# EAGLE design zx48_to_128-EASY_6b (EAGLE 5.11)
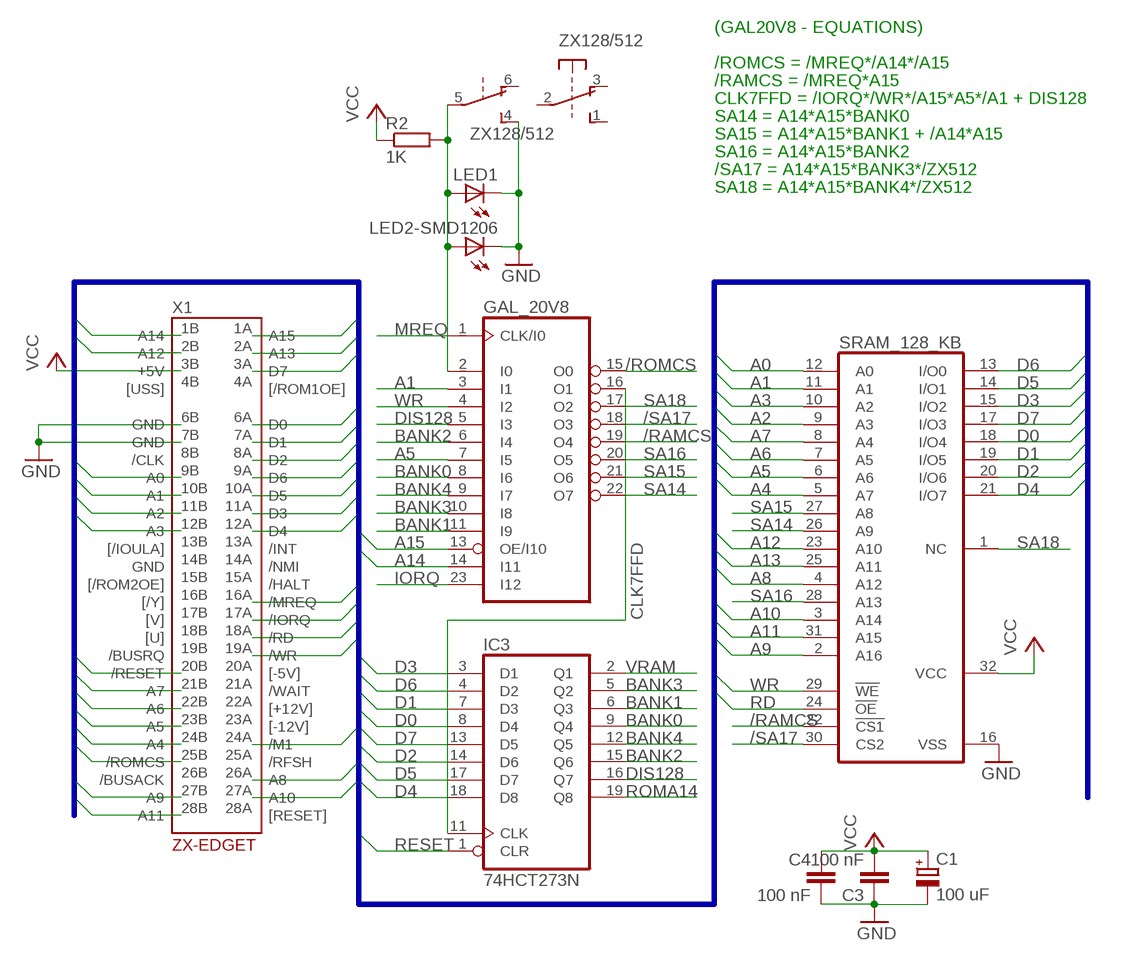
[diagram p0: schematic, sheet 1]

## Parts
C1  100 uF  CPOL-EUTT2D5L  [TT2D5L]
C3  100 nF  C-EU050-024X044  [C050-024X044]
C4  100 nF  C-EUC0805K  [C0805K]
GAL_20V8  20V8  [DIL24-3]
IC3  74HCT273N  [DIL20]
LED1  LED3MM  [LED3MM]
LED2-SMD1206  LEDCHIPLED_1206  [CHIPLED_1206]
R2  1K  R-EU_0204/2V  [0204V]
SRAM_128_KB  628128P  [DIL32]
X1  ZX-EDGET  [ZX-THR]
ZX128/512  9077-2  [9077-2]

## Nets
/RAMCS: GAL_20V8.19(O4) SRAM_128_KB.22(!CS1)
/ROMCS: GAL_20V8.15(O0)
/SA17: GAL_20V8.18(O3) SRAM_128_KB.30(CS2)
A0: SRAM_128_KB.12(A0) X1.9B(A0)
A1: GAL_20V8.3(I1) SRAM_128_KB.11(A1) X1.10B(A1)
A2: SRAM_128_KB.9(A3) X1.11B(A2)
A3: SRAM_128_KB.10(A2) X1.12B(A3)
A4: SRAM_128_KB.5(A7) X1.24B(A4)
A5: GAL_20V8.7(I5) SRAM_128_KB.6(A6) X1.23B(A5)
A6: SRAM_128_KB.7(A5) X1.22B(A6)
A7: SRAM_128_KB.8(A4) X1.21B(A7)
A8: SRAM_128_KB.4(A12) X1.26A(A8)
A9: SRAM_128_KB.2(A16) X1.27B(A9)
A10: SRAM_128_KB.3(A14) X1.27A(A10)
A11: SRAM_128_KB.31(A15) X1.28B(A11)
A12: SRAM_128_KB.23(A10) X1.2B(A12)
A13: SRAM_128_KB.25(A11) X1.2A(A13)
A14: GAL_20V8.14(I11) X1.1B(A14)
A15: GAL_20V8.13(OE/I10) X1.1A(A15)
BANK0: GAL_20V8.8(I6) IC3.9(Q4)
BANK1: GAL_20V8.11(I9) IC3.6(Q3)
BANK2: GAL_20V8.6(I4) IC3.15(Q6)
BANK3: GAL_20V8.10(I8) IC3.5(Q2)
BANK4: GAL_20V8.9(I7) IC3.12(Q5)
CLK7FFD: GAL_20V8.16(O1) IC3.11(CLK)
D0: IC3.8(D4) SRAM_128_KB.18(I/O4) X1.6A(D0)
D1: IC3.7(D3) SRAM_128_KB.19(I/O5) X1.7A(D1)
D2: IC3.14(D6) SRAM_128_KB.20(I/O6) X1.8A(D2)
D3: IC3.3(D1) SRAM_128_KB.15(I/O2) X1.11A(D3)
D4: IC3.18(D8) SRAM_128_KB.21(I/O7) X1.12A(D4)
D5: IC3.17(D7) SRAM_128_KB.14(I/O1) X1.10A(D5)
D6: IC3.4(D2) SRAM_128_KB.13(I/O0) X1.9A(D6)
D7: IC3.13(D5) SRAM_128_KB.17(I/O3) X1.3A(D7)
DIS128: GAL_20V8.5(I3) IC3.16(Q7)
GND: C1.- C3.1 C4.2 LED1.K(C) LED2-SMD1206.C SRAM_128_KB.16(VSS) X1.6B(GND) X1.7B(GND) ZX128/512.4(2:S)
IORQ: GAL_20V8.23(I12) X1.17A(/IORQ)
M1: X1.24A(/M1)
MREQ: GAL_20V8.1(CLK/I0) X1.16A(/MREQ)
N$1: GAL_20V8.2(I0) LED1.A LED2-SMD1206.A R2.2 ZX128/512.5(2:P)
RD: SRAM_128_KB.24(!OE) X1.18A(/RD)
RESET: IC3.1(CLR) X1.20B(/RESET)
ROMA14: IC3.19(Q8)
ROMCS: X1.25B(/ROMCS)
SA14: GAL_20V8.22(O7) SRAM_128_KB.26(A9)
SA15: GAL_20V8.21(O6) SRAM_128_KB.27(A8)
SA16: GAL_20V8.20(O5) SRAM_128_KB.28(A13)
SA18: GAL_20V8.17(O2) SRAM_128_KB.1(NC)
VCC: C1.+ C3.2 C4.1 R2.1 SRAM_128_KB.32(VCC) X1.3B(+5V)
VRAM: IC3.2(Q1)
WR: GAL_20V8.4(I2) SRAM_128_KB.29(!WE) X1.19A(/WR)
Unconnected: X1.4A([/ROM1OE]) X1.4B([USS]) X1.8B(/CLK) X1.13A(/INT) X1.13B([/IOULA]) X1.14A(/NMI) X1.14B(GND) X1.15A(/HALT) X1.15B([/ROM2OE]) X1.16B([/Y]) X1.17B([V]) X1.18B([U]) X1.19B(/BUSRQ) X1.20A([-5V]) X1.21A(/WAIT) X1.22A([+12V]) X1.23A([-12V]) X1.25A(/RFSH) X1.26B(/BUSACK) X1.28A([RESET]) ZX128/512.1(1:S) ZX128/512.2(1:P) ZX128/512.3(1:O) ZX128/512.6(2:O)

## Buses
A[0..15],D[0..7],MREQ,IORQ,RD,WR,M1,ROMCS,RESET

## Notes on the sheet
- (GAL20V8 - EQUATIONS)
- /ROMCS = /MREQ*/A14*/A15
- /RAMCS = /MREQ*A15
- CLK7FFD = /IORQ*/WR*/A15*A5*/A1 + DIS128
- SA14 = A14*A15*BANK0
- SA15 = A14*A15*BANK1 + /A14*A15
- SA16 = A14*A15*BANK2
- /SA17 = A14*A15*BANK3*/ZX512
- SA18 = A14*A15*BANK4*/ZX512

## Power pins joined to a net without a drawn wire
GND: GAL_20V8.12(GND) IC3.10(GND)
VCC: GAL_20V8.24(VCC) IC3.20(VCC)

## Library data of the parts
C1 = rcl:CPOL-EU: POLARIZED CAPACITOR, European symbol
C3 C4 = rcl:C-EU: CAPACITOR, European symbol
GAL_20V8 = pal:20V8: PAL
IC3 = 74xx-eu:74*273: Octal D type FLIP FLOP, clear
LED1 LED2-SMD1206 = led:LED: LED OSRAM: - CHIPLED LG R971, LG N971, LY N971, LG Q971, LY Q971, LO R971, LY R971 LH N974, LH R974 LS Q976, LO Q976, LY Q976 LO Q996 - Hyper CHIPLED LW Q18S LB Q993, LB Q99A, LB R99A - SideLED LS A670, LO A670, LY A670, LG A670, LP A670 LB A673, LV A673, LT A673, LW A673 LH A674 LY A675 LS A676, LA A676, LO A676, LY A676, LW A676 LS A679, LY A679, LG A679 - Hyper Micro SIDELED® LS Y876, LA Y876, LO Y876, LY Y876 LT Y87S - SmartLED LW L88C, LW L88S LB L89C, LB L89S, LG L890 LS L89K, LO L89K, LY L89K LS L896, LA L896, LO L896, LY L896 - TOPLED LS T670, LO T670, LY T670, LG T670, LP T670 LSG T670, LSP T670, LSY T670, LOP T670, LYG T670 LG T671, LOG T671, LSG T671 LB T673, LV T673, LT T673, LW T673 LH T674 LS T676, LA T676, LO T676, LY T676, LB T676, LH T676, LSB T676, LW T676 LB T67C, LV T67C, LT T67C, LS T67K, LO T67K, LY T67K, LW E67C LS E67B, LA E67B, LO E67B, LY E67B, LB E67C, LV E67C, LT E67C LW T67C LS T679, LY T679, LG T679 LS T770, LO T770, LY T770, LG T770, LP T770 LB T773, LV T773, LT T773, LW T773 LH T774 LS E675, LA E675, LY E675, LS T675 LS T776, LA T776, LO T776, LY T776, LB T776 LHGB T686 LT T68C, LB T68C - Hyper Mini TOPLED® LB M676 - Mini TOPLED Santana® LG M470 LS M47K, LO M47K, LY M47K Source: http://www.osram.convergy.de LUXEON: - LUMILED® LXK2-PW12-R00, LXK2-PW12-S00, LXK2-PW14-U00, LXK2-PW14-V00 LXK2-PM12-R00, LXK2-PM12-S00, LXK2-PM14-U00 LXK2-PE12-Q00, LXK2-PE12-R00, LXK2-PE12-S00, LXK2-PE14-T00, LXK2-PE14-U00 LXK2-PB12-K00, LXK2-PB12-L00, LXK2-PB12-M00, LXK2-PB14-N00, LXK2-PB14-P00, LXK2-PB14-Q00 LXK2-PR12-L00, LXK2-PR12-M00, LXK2-PR14-Q00, LXK2-PR14-R00 LXK2-PD12-Q00, LXK2-PD12-R00, LXK2-PD12-S00 LXK2-PH12-R00, LXK2-PH12-S00 LXK2-PL12-P00, LXK2-PL12-Q00, LXK2-PL12-R00 Source: www.luxeon.com KINGBRIGHT: KA-3528ASYC Source: www.kingbright.com
R2 = rcl:R-EU_: RESISTOR, European symbol
SRAM_128_KB = memory-hitachi:628128P: MEMORY
X1 = YABUS:ZX-EDGE: Opposite part for ZX-Spectrum system bus
ZX128/512 = switch-misc:9077-2: MARQUARDT SWITCH

## Board
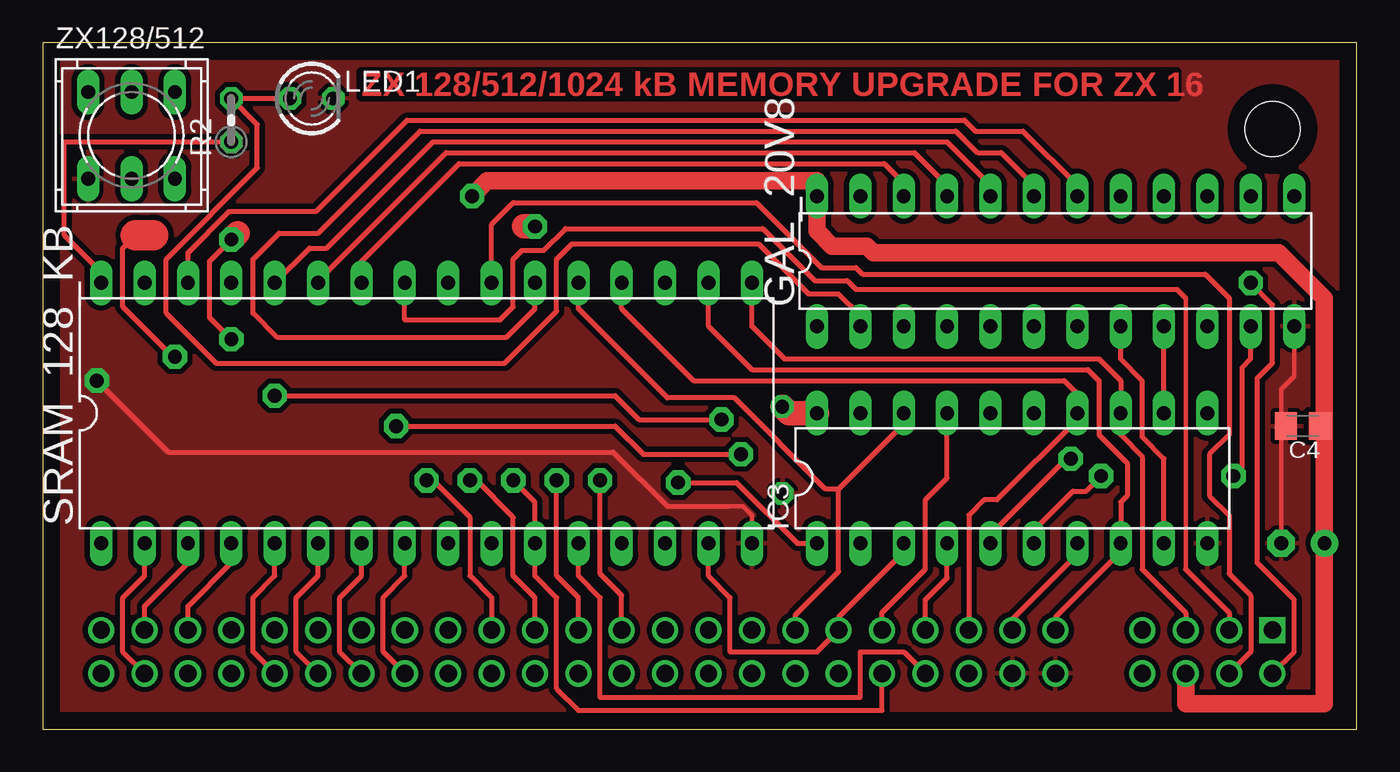
[diagram p1: board, top side]
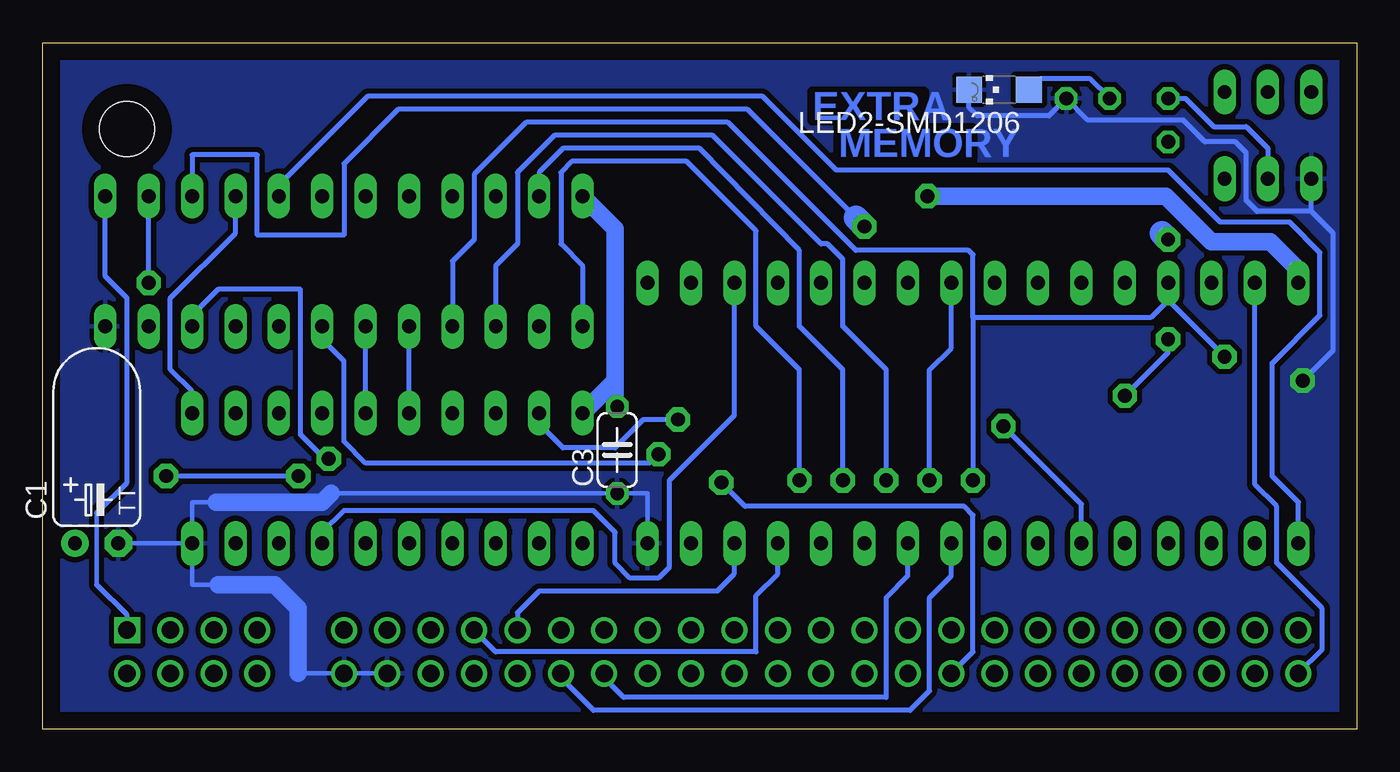
[diagram p2: board, bottom side, seen from below]

Size 76.94 x 40.18 mm. Coordinates in mm from the lower left corner, seen from the top.
Outline: 0,0 76.94,0 76.94,40.18 0,40.18 0,0
Copper layers (1*16): Top 0.035mm / dielectric 1.5mm / Bottom 0.035mm
Design rules "default": minimum track width 10mil, minimum drill 24mil, track to track 8mil, track to pad 8mil, pad to pad 8mil, via to via 8mil, smd to smd 8mil, copper to edge 40mil, drill to drill 8mil, minimum pad ring 10mil, minimum via ring 8mil, stop-mask expansion 4mil, vias tented up to drill 0mil, thermal gap 10mil
Holes 3.2 mm at 72,35.14

### Footprints (pad centres in the part's own frame; a part is rotated, then mirrored left to right if it is on the bottom)
TT2D5L = drill 0.813 pad 1.6 round: + -1.27,0 | drill 0.813 pad 1.6 octagon: - 1.27,0
C050-024X044 = drill 0.813 octagon: 1 -2.54,0; 2 2.54,0
C0805K = smd 1.3 x 1.6: 1 -1,0; 2 1,0
DIL24-3 = drill 0.813 long: 1 -13.97,-3.81; 2 -11.43,-3.81; 3 -8.89,-3.81; 4 -6.35,-3.81; 5 -3.81,-3.81; 6 -1.27,-3.81; 7 1.27,-3.81; 8 3.81,-3.81; 9 6.35,-3.81; 10 8.89,-3.81; 11 11.43,-3.81; 12 13.97,-3.81; 13 13.97,3.81; 14 11.43,3.81; 15 8.89,3.81; 16 6.35,3.81; 17 3.81,3.81; 18 1.27,3.81; 19 -1.27,3.81; 20 -3.81,3.81; 21 -6.35,3.81; 22 -8.89,3.81; 23 -11.43,3.81; 24 -13.97,3.81
DIL20 = drill 0.813 long: 1 -11.43,-3.81; 2 -8.89,-3.81; 3 -6.35,-3.81; 4 -3.81,-3.81; 5 -1.27,-3.81; 6 1.27,-3.81; 7 3.81,-3.81; 8 6.35,-3.81; 9 8.89,-3.81; 10 11.43,-3.81; 11 11.43,3.81; 12 8.89,3.81; 13 6.35,3.81; 14 3.81,3.81; 15 1.27,3.81; 16 -1.27,3.81; 17 -3.81,3.81; 18 -6.35,3.81; 19 -8.89,3.81; 20 -11.43,3.81
LED3MM = drill 0.813 octagon: A -1.27,0; K 1.27,0
CHIPLED_1206 = smd 1.5 x 1.5: A 0,-1.75; C 0,1.75
0204V = drill 0.813 octagon: 1 -1.27,0; 2 1.27,0
DIL32 = drill 0.813 long: 1 -19.05,-7.62; 2 -16.51,-7.62; 3 -13.97,-7.62; 4 -11.43,-7.62; 5 -8.89,-7.62; 6 -6.35,-7.62; 7 -3.81,-7.62; 8 -1.27,-7.62; 9 1.27,-7.62; 10 3.81,-7.62; 11 6.35,-7.62; 12 8.89,-7.62; 13 11.43,-7.62; 14 13.97,-7.62; 15 16.51,-7.62; 16 19.05,-7.62; 17 19.05,7.62; 18 16.51,7.62; 19 13.97,7.62; 20 11.43,7.62; 21 8.89,7.62; 22 6.35,7.62; 23 3.81,7.62; 24 1.27,7.62; 25 -1.27,7.62; 26 -3.81,7.62; 27 -6.35,7.62; 28 -8.89,7.62; 29 -11.43,7.62; 30 -13.97,7.62; 31 -16.51,7.62; 32 -19.05,7.62
ZX-THR = drill 1.016 square: 1A -34.29,1.27 | drill 1.016 round: 1B -34.29,-1.27; 2A -31.75,1.27; 2B -31.75,-1.27; 3A -29.21,1.27; 3B -29.21,-1.27; 4A -26.67,1.27; 4B -26.67,-1.27; 6A -21.59,1.27; 6B -21.59,-1.27; 7A -19.05,1.27; 7B -19.05,-1.27; 8A -16.51,1.27; 8B -16.51,-1.27; 9A -13.97,1.27; 9B -13.97,-1.27; 10A -11.43,1.27; 10B -11.43,-1.27; 11A -8.89,1.27; 11B -8.89,-1.27; 12A -6.35,1.27; 12B -6.35,-1.27; 13A -3.81,1.27; 13B -3.81,-1.27; 14A -1.27,1.27; 14B -1.27,-1.27; 15A 1.27,1.27; 15B 1.27,-1.27; 16A 3.81,1.27; 16B 3.81,-1.27; 17A 6.35,1.27; 17B 6.35,-1.27; 18A 8.89,1.27; 18B 8.89,-1.27; 19A 11.43,1.27; 19B 11.43,-1.27; 20A 13.97,1.27; 20B 13.97,-1.27; 21A 16.51,1.27; 21B 16.51,-1.27; 22A 19.05,1.27; 22B 19.05,-1.27; 23A 21.59,1.27; 23B 21.59,-1.27; 24A 24.13,1.27; 24B 24.13,-1.27; 25A 26.67,1.27; 25B 26.67,-1.27; 26A 29.21,1.27; 26B 29.21,-1.27; 27A 31.75,1.27; 27B 31.75,-1.27; 28A 34.29,1.27; 28B 34.29,-1.27
9077-2 = drill 0.813 long: 1 -2.54,2.54; 2 0,2.54; 3 2.54,2.54; 4 -2.54,-2.54; 5 0,-2.54; 6 2.54,-2.54

### Placement (x,y rotation side)
C1  73.78,10.88 0 bottom
C3  43.3,16.34 90 bottom
C4  73.78,17.74 180 top
GAL_20V8  59.3,27.39 0 top
IC3  56.76,14.69 0 top
LED1  15.74,36.92 0 top
LED2-SMD1206  20.95,37.43 90 bottom
R2  11.04,35.65 90 top
SRAM_128_KB  22.47,18.5 0 top
X1  37.71,4.53 0 bottom
ZX128/512  5.2,34.76 0 top

### Tracks (layer width: path | path; a pad name or v marks a point on that pad's centre or on a via)
/RAMCS
  Top 0.305: GAL_20V8.19 58.03,31.84 56.13,33.74 54.73,33.74 53.46,35.01 22.09,35.01 16.12,29.04 13.84,29.04 12.31,27.52 12.31,24.35 13.71,22.95 27.17,22.95 28.82,24.6 SRAM_128_KB.22
/ROMCS  (via drill 0.8 pad 1.42)
  Top 1.422: v28.82,29.43 28.19,29.43
  Bottom 0.305: GAL_20V8.15 68.19,33.62 64.38,33.62 64.38,28.92 59.3,28.92 59.3,33.11 56.13,36.28 35.68,36.28 29.33,29.93
  Bottom 1.422: v28.82,29.43 29.33,29.93
/SA17
  Top 0.305: GAL_20V8.18 60.57,31.84 57.4,35.01 54.6,35.01 53.97,35.65 21.33,35.65 16,30.32 10.92,30.32 8.5,27.9 SRAM_128_KB.30
A0
  Top 0.305: SRAM_128_KB.12 31.36,8.98 32.63,7.71 32.63,1.87 47.87,1.87 47.87,4.53 50.41,4.53 X1.9B
A1  (via drill 0.81 pad 1.42)
  Top 0.305: v27.55,14.57 28.82,13.3 SRAM_128_KB.11 28.82,8.98 30.09,7.71 30.09,2.38 31.36,1.1 49.14,1.1 X1.10B
  Bottom 0.305: GAL_20V8.3 50.41,27.14 49.14,28.41 49.14,32.6 46.98,34.76 37.71,34.76 31.36,28.41 30.98,28.41 30.09,27.52 30.09,23.58 27.55,21.04 v27.55,14.57
A2
  Bottom 0.305: SRAM_128_KB.9 23.74,8.98 25.01,7.71 25.01,2.25 26.16,1.1 44.7,1.1 46.6,3.01 X1.11B
A3
  Bottom 0.305: SRAM_128_KB.10 26.28,8.98 27.55,7.71 27.55,1.87 42.92,1.87 44.06,3.01 X1.12B
A4
  Top 0.305: SRAM_128_KB.5 13.58,8.98 12.31,7.71 12.31,4.53 X1.24B
A5  (via drill 0.81 pad 1.42)
  Top 0.305: SRAM_128_KB.6 16.12,8.98 14.85,7.71 14.85,4.53 X1.23B | v20.7,17.74 33.52,17.74 35.17,16.09 v40.89,16.09
  Bottom 0.305: GAL_20V8.7 60.57,22.82 59.3,21.55 59.3,16.85 58.03,15.58 41.4,15.58 v40.89,16.09 | SRAM_128_KB.6 16.12,13.17 v20.7,17.74
A6
  Top 0.305: SRAM_128_KB.7 18.66,8.98 17.39,7.71 17.39,4.53 X1.22B
A7
  Top 0.305: SRAM_128_KB.8 21.2,8.98 19.93,7.71 19.93,4.53 X1.21B
A8
  Top 0.305: SRAM_128_KB.4 11.04,9.74 8.5,7.2 X1.26A
A9
  Top 0.305: SRAM_128_KB.2 5.96,8.98 4.69,7.71 4.69,4.53 X1.27B
A10
  Top 0.305: SRAM_128_KB.3 8.5,9.74 5.96,7.2 X1.27A
A11
  Bottom 0.305: SRAM_128_KB.31 5.96,14.31 4.69,13.04 4.69,9.74 2.03,7.07 2.03,4.66 X1.28B
A12
  Top 0.305: SRAM_128_KB.23 26.28,29.55 27.55,30.82 41.78,30.82 45.59,27.01 47.62,27.01 48,26.63 68.07,26.63 69.46,25.23 69.46,17.23 68.32,16.09 68.32,13.68 69.46,12.54 69.46,9.11 70.73,7.84 70.73,4.53 X1.2B
A13
  Top 0.254: 66.92,25.23 66.92,9.36
  Top 0.305: 66.92,25.23 66.42,25.74 47.62,25.74 47.11,26.25 45.21,26.25 42.16,29.3 30.6,29.3 29.33,28.03 28.06,28.03 27.55,27.52 27.55,24.73 26.79,23.96 21.2,23.96 SRAM_128_KB.25 | 66.92,9.36 69.46,6.82 X1.2A
A14  (via drill 0.81 pad 1.42)
  Top 0.305: v70.73,26.12 72,24.85 72,21.43 71.12,20.54 71.12,9.74 73.27,7.58 73.27,4.53 X1.1B
  Bottom 0.305: v70.73,26.12 GAL_20V8.14
A15
  Bottom 0.254: 73.78,8.47 73.78,12.66
  Bottom 0.305: 73.78,8.47 72,6.69 X1.1A | 73.78,12.66 72,14.44 72,25.23 73.27,26.5 GAL_20V8.13
BANK0
  Top 0.305: IC3.9 65.65,15.84 64.38,17.11 64.38,20.41 63.11,21.68 GAL_20V8.8
BANK1  (via drill 0.81 pad 1.42)
  Top 0.305: GAL_20V8.11 70.73,21.68 70.23,21.17 70.23,15.33 v69.72,14.82 | IC3.6 58.03,11.65 60.32,13.93 61.08,13.93 v61.97,14.82
  Bottom 0.305: v61.97,14.82 v69.72,14.82
BANK2
  Bottom 0.305: IC3.15 GAL_20V8.6
BANK3  (via drill 0.81 pad 1.42)
  Top 0.305: IC3.5 55.49,11.39 59.94,15.84 v60.19,15.84
  Bottom 0.305: v60.19,15.84 60.45,15.84 61.84,17.23 61.84,25.74 66.67,25.74 68.19,24.22 GAL_20V8.10
BANK4
  Top 0.305: IC3.12 GAL_20V8.9
CLK7FFD
  Bottom 0.305: IC3.11 68.19,19.77 69.46,21.04 69.46,25.23 65.65,29.04 GAL_20V8.16
D0
  Top 0.305: SRAM_128_KB.18 38.98,23.58 41.52,21.04 61.21,21.04 61.84,20.41 61.84,17.23 63.49,15.58 63.49,13.68 63.11,13.3 IC3.8 63.11,10.38 59.3,6.57 X1.6A
D1
  Top 0.305: IC3.7 60.57,10.25 56.76,6.44 X1.7A
  Bottom 0.305: IC3.7 60.57,11.52 59.3,12.79 44.7,12.79 43.43,11.52 43.43,9.74 42.54,8.85 40.89,8.85 40.25,9.49 40.25,14.57 36.44,18.38 SRAM_128_KB.19
D2
  Top 0.305: SRAM_128_KB.20 33.9,24.6 38.09,20.41 59.81,20.41 60.57,19.65 IC3.14 60.57,18.12 55.88,13.42 55.11,13.42 54.22,12.54 X1.8A
D3
  Top 0.305: SRAM_128_KB.15 38.98,8.98 40.25,7.71 40.25,4.53 45.33,4.53 X1.11A 46.6,6.57 50.41,10.38 IC3.3
D4
  Top 0.305: 46.6,14.06 50.41,17.87 IC3.18 | SRAM_128_KB.21 31.36,24.6 36.57,19.39 40.51,19.39 45.84,14.06 46.6,14.06 | X1.12A 44.06,6.69 46.6,9.23 46.6,14.06
D5
  Top 0.305: IC3.17 52.95,14.69 51.68,13.42 51.68,9.36 49.14,6.82 X1.10A
  Bottom 0.305: SRAM_128_KB.14 36.44,9.11 37.46,8.09 47.87,8.09 49.14,6.82 X1.10A
D6
  Top 0.305: IC3.4 52.95,8.85 51.68,7.58 X1.9A
  Bottom 0.305: SRAM_128_KB.13 33.9,9.11 35.17,7.84 35.17,4.53 50.41,4.53 X1.9A
D7
  Top 0.305: SRAM_128_KB.17 41.52,23.58 43.43,21.68 61.84,21.68 63.11,20.41 IC3.13 63.11,17.23 64.38,15.96 64.38,9.36 66.92,6.82 X1.3A
DIS128
  Bottom 0.305: IC3.16 GAL_20V8.5
GND  (via drill 0.81 pad 1.42)
  Top 0.254: GAL_20V8.12 73.27,20.66 72.51,19.9 72.51,17.74 C1.- | SRAM_128_KB.16 41.52,12.54 41.02,13.04 40.13,13.04
  Top 0.305: 40.13,13.04 36.57,13.04 33.4,16.22 7.36,16.22 v3.17,20.41 | 72.51,17.74 C4.2
  Bottom 0.254: SRAM_128_KB.16 41.52,13.8 C3.1 60.07,13.8 | 66.8,13.3 68.19,13.3 IC3.10 | IC3.10 C1.- | 66.67,8.47 68.19,8.47 IC3.10 | 61.97,3.26 X1.6B X1.7B
  Bottom 0.305: v3.17,20.41 1.39,22.19 1.39,29.04 2.66,30.32 | LED2-SMD1206.C 22.7,36.38 22.22,35.9 18.03,35.9 LED1.K 15.74,35.65 10.15,35.65 8.88,34.38 7.11,34.38 6.47,33.74 6.47,30.95 5.84,30.32 2.66,30.32 | 2.66,30.32 ZX128/512.4
  Bottom 1.016: 60.07,13.8 60.57,13.3 66.8,13.3 | 61.97,3.26 61.97,7.07 63.37,8.47 66.67,8.47
  pour Top (isolate 0.305): 0.1,39.88 76.8,39.88 76.8,0.16 0.1,0.16
  pour Bottom (isolate 0.305): 0.1,0.19 0.1,39.88 76.9,39.88 76.77,0.19
IORQ  (via drill 0.81 pad 1.42)
  Top 0.305: X1.17A 31.36,7.71 30.09,8.98 v30.09,14.57
  Bottom 0.305: GAL_20V8.23 47.87,32.6 46.48,34 38.48,34 32.63,28.03 32.63,23.58 30.09,21.04 v30.09,14.57
MREQ  (via drill 0.81 pad 1.42)
  Top 0.305: X1.16A 33.9,7.84 32.63,9.11 v32.63,14.57
  Bottom 0.305: GAL_20V8.1 45.33,27.14 46.6,28.41 46.6,32.6 45.97,33.24 39.24,33.24 35.17,29.17 35.17,23.58 32.63,21.04 v32.63,14.57
N$1
  Top 0.305: GAL_20V8.2 47.87,24.22 46.6,25.49 44.83,25.49 41.9,28.41 30.98,28.41 30.09,27.52 30.09,24.47 27.05,21.43 10.15,21.43 7.23,24.35 7.23,27.52 12.57,32.86 12.57,35.4 R2.2 LED1.A
  Bottom 0.305: R2.2 10.03,36.92 8.38,35.27 6.47,35.27 5.2,34 ZX128/512.5 | LED2-SMD1206.A 18.57,38.06 15.62,38.06 LED1.A
RD  (via drill 0.81 pad 1.42)
  Top 0.305: X1.18A 28.82,7.71 27.55,8.98 27.55,12.41 25.39,14.57 v25.01,14.57
  Bottom 0.305: v25.01,14.57 25.01,21.04 23.74,22.31 SRAM_128_KB.24
RESET  (via drill 0.81 pad 1.42)
  Top 0.305: IC3.1 44.19,10.88 40.63,14.44 v37.21,14.44
  Bottom 0.305: v37.21,14.44 35.81,13.04 22.98,13.04 22.47,12.54 22.47,4.53 X1.20B
ROMA14  (via drill 0.8 pad 1.42)
  Top 0.305: v11.04,28.66 9.77,27.39 9.77,24.09 v11.04,22.82 | v13.58,19.52 33.52,19.52 34.92,18.12 v39.75,18.12
  Top 1.422: v11.04,28.66 11.42,29.04
  Bottom 0.305: IC3.19 47.87,17.87 46.48,16.47 43.43,16.47 41.78,18.12 v39.75,18.12 | v11.04,22.82 11.04,22.06 v13.58,19.52
  Bottom 1.422: v11.04,28.66 11.42,29.04
SA14
  Top 0.305: GAL_20V8.22 50.41,31.97 49.27,33.11 24.38,33.11 18.66,27.39 SRAM_128_KB.26
SA15
  Top 0.305: GAL_20V8.21 52.95,31.84 51.05,33.74 23.62,33.74 16.12,26.25 SRAM_128_KB.27
SA16
  Top 0.305: GAL_20V8.20 55.49,31.84 52.95,34.38 22.86,34.38 16.63,28.16 15.62,28.16 SRAM_128_KB.28
SA18
  Bottom 0.305: GAL_20V8.17 63.11,31.84 57.91,37.05 34.79,37.05 30.48,32.73 11.04,32.73 8,29.68 3.93,29.68 2.15,27.9 2.15,24.22 4.95,21.43 4.95,14.82 3.42,13.3 SRAM_128_KB.1
VCC  (via drill 0.81 pad 1.42)
  Top 0.305: SRAM_128_KB.32 3.42,26.76 1.27,28.92 1.27,34.38 R2.1 | C4.1 75.05,17.74 75.05,17.87
  Top 1.016: v25.14,31.2 26.03,32.09 45.33,32.09 GAL_20V8.24 45.33,29.17 46.22,28.28 48.25,28.28 48.64,27.9 72.39,27.9 75.05,25.23 75.05,17.87 C1.+ 75.05,1.49 66.92,1.49 X1.3B
  Top 1.422: C3.2 43.68,18.5 IC3.20
  Bottom 1.016: GAL_20V8.24 43.43,29.3 43.43,20.41 | 43.43,20.41 IC3.20 | v25.14,31.2 11.17,31.2 8.5,28.54 5.08,28.54 3.42,26.89 SRAM_128_KB.32 | C3.2 43.43,19.01 43.43,20.41
WR  (via drill 0.8 pad 1.42, 0.81 pad 1.42)
  Top 0.305: X1.19A 26.28,7.71 25.01,8.98 25.01,12.41 22.86,14.57 v22.47,14.57 | 5.46,28.92 4.69,28.16 4.69,24.73 7.62,21.81 v7.74,21.81
  Top 1.778: 5.46,28.92 6.47,28.92
  Bottom 0.305: GAL_20V8.4 52.95,27.39 51.68,28.66 51.68,32.47 48.64,35.52 36.82,35.52 29.33,28.03 22.73,28.03 22.47,27.77 22.47,24.09 | 11.04,25.11 12.06,24.09 22.47,24.09 | 22.47,24.09 v22.47,14.57 | v7.74,21.81 11.04,25.11 | 11.04,25.11 SRAM_128_KB.29

### Text on the board
Top: ZX 128/512/1024 kB MEMORY UPGRADE FOR ZX 16
Bottom: EXTRA | MEMORY